# EAGLE design mahmuduino (EAGLE 9.6.1)
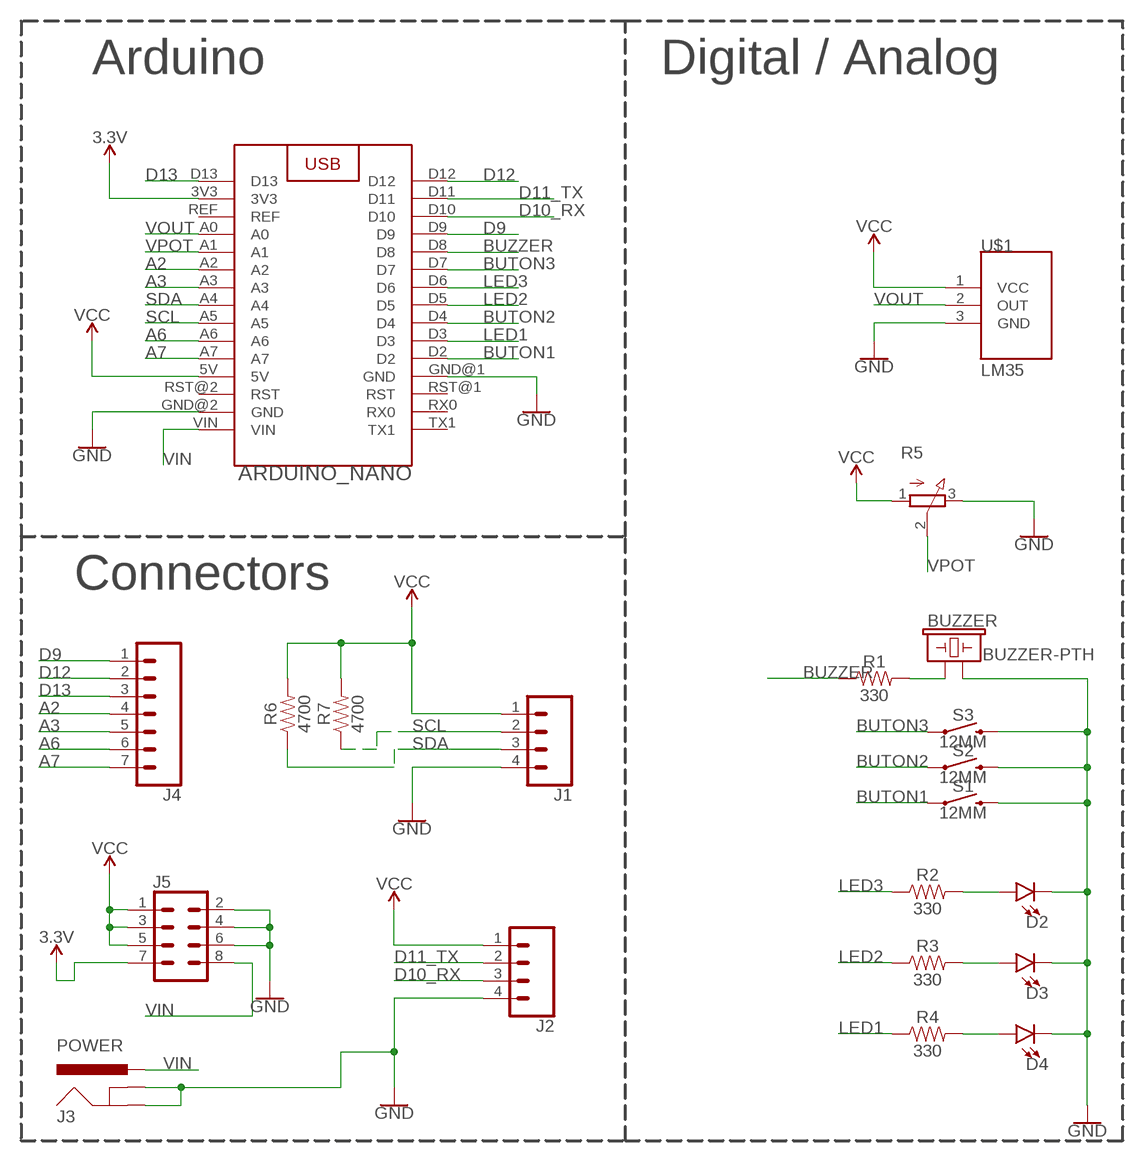
[diagram p0: schematic, sheet 1]

## Parts
ARDUINO_NANO  ARDUINO_NANO  [ARDUINO_NANO]
BUZZER  BUZZER-PTH  [BUZZER-12MM]
D2  LED-3MM-NO_SILK  [LED_3MM-NS]
D3  LED-3MM-NO_SILK  [LED_3MM-NS]
D4  LED-3MM-NO_SILK  [LED_3MM-NS]
J1  CONN_04  [1X04]
J2  CONN_04  [1X04]
J3  POWER  POWER_JACK  [POWER_JACK_PTH]
J4  CONN_07  [1X07]
J5  CONN_04X2  [2X4]
R1  330  1KOHM-HORIZ-1/4W-5%  [AXIAL-0.3]
R2  330  1KOHM-HORIZ-1/4W-5%  [AXIAL-0.3]
R3  330  1KOHM-HORIZ-1/4W-5%  [AXIAL-0.3]
R4  330  1KOHM-HORIZ-1/4W-5%  [AXIAL-0.3]
R5  3RP/1610N  [3RP/1610N]
R6  4700  1KOHM-HORIZ-1/4W-5%  [AXIAL-0.3]
R7  4700  1KOHM-HORIZ-1/4W-5%  [AXIAL-0.3]
S1  12MM  MOMENTARY-SWITCH-SPST-PTH-12MM  [TACTILE_SWITCH_PTH_12MM]
S2  12MM  MOMENTARY-SWITCH-SPST-PTH-12MM  [TACTILE_SWITCH_PTH_12MM]
S3  12MM  MOMENTARY-SWITCH-SPST-PTH-12MM  [TACTILE_SWITCH_PTH_12MM]
U$1  LM35  [TO-92]

## Nets
3.3V: ARDUINO_NANO.3V3 J5.7
A2: ARDUINO_NANO.A2 J4.4
A3: ARDUINO_NANO.A3 J4.5
A6: ARDUINO_NANO.A6 J4.6
A7: ARDUINO_NANO.A7 J4.7
BUTON1: ARDUINO_NANO.D2 S1.1
BUTON2: ARDUINO_NANO.D4 S2.1
BUTON3: ARDUINO_NANO.D7 S3.1
BUZZER: ARDUINO_NANO.D8 R1.P$1
D9: ARDUINO_NANO.D9 J4.1
D10_RX: ARDUINO_NANO.D10 J2.3
D11_TX: ARDUINO_NANO.D11 J2.2
D12: ARDUINO_NANO.D12 J4.2
D13: ARDUINO_NANO.D13 J4.3
GND: ARDUINO_NANO.GND@1(GND) ARDUINO_NANO.GND@2(GND) BUZZER.- D2.K(C) D3.K(C) D4.K(C) J1.4 J2.4 J3.GND J3.GNDBREAK J5.2 J5.4 J5.6 R5.3(E) S1.3 S2.3 S3.3 U$1.3(GND)
LED1: ARDUINO_NANO.D3 R4.P$1
LED2: ARDUINO_NANO.D5 R3.P$1
LED3: ARDUINO_NANO.D6 R2.P$1
N$2: BUZZER.+ R1.P$2
N$6: D2.A R2.P$2
N$7: D3.A R3.P$2
N$8: D4.A R4.P$2
SCL: ARDUINO_NANO.A5 J1.2 R7.P$1
SDA: ARDUINO_NANO.A4 J1.3 R6.P$1
VCC: ARDUINO_NANO.5V J1.1 J2.1 J5.1 J5.3 J5.5 R5.1(A) R6.P$2 R7.P$2 U$1.1(VCC)
VIN: ARDUINO_NANO.VIN J3.PWR J5.8
VOUT: ARDUINO_NANO.A0 U$1.2(OUT)
VPOT: ARDUINO_NANO.A1 R5.2(S)
Unconnected: ARDUINO_NANO.REF ARDUINO_NANO.RST@1(RST) ARDUINO_NANO.RST@2(RST) ARDUINO_NANO.RX0 ARDUINO_NANO.TX1

## Notes on the sheet
- Arduino | Digital / Analog
- Connectors

## Library data of the parts
ARDUINO_NANO = LezzetliRobotTarifleriLib:ARDUINO_NANO: Ardunio Nano Device
BUZZER = SparkFun-Electromechanical:BUZZER: Buzzer Small round buzzers that operate around the audible 2kHz range. You can use these as speakers to create simple music or user interfaces. Variant Overview: PTH - Mini Speaker - PC Mount 12mm 2.048kHz <https://www.sparkfun.com/products/7950> PTH_KIT - Mini Speaker - PC Mount 12mm 2.048kHz <https://www.sparkfun.com/products/7950> KIT simplifies soldering by adding stop mask to one side of the pads. PTH_NO_SILK - Mini Speaker - PC Mount 12mm 2.048kHz <https://www.sparkfun.com/products/7950> No silkscreen indicator of buzzer outline. PTH_KIT_NO_SILK - Mini Speaker - PC Mount 12mm 2.048kHz <https://www.sparkfun.com/products/7950> KIT package w/o silkscreen SMD - Buzzer Audio Magnetic (CCV-084B16) SMD buzzer used on, e.g. the LilyPad Buzzer <https://www.sparkfun.com/products/8463> and RFID USB Reader <https://www.sparkfun.com/products/9963>. SMD_KIT - Buzzer Audio Magnetic (CCV-084B16) SMD Buzzer with elongated pins to make soldering easier. Used on the SparkFun Simon Says - Surface Mount Soldering Kit <https://www.sparkfun.com/products/10935>.; PROD_ID: COMP-08253; SF_SKU: COM-07950
D2-D4 = SparkFun-LED:LED: LED (Generic) Standard schematic elements and footprints for 5mm, 3mm, 1206, and 0603 sized LEDs. Generic LEDs with no color specified.
J1 J2 = SparkFun-Connectors:CONN_04: Multi connection point. Often used as Generic Header-pin footprint for 0.1 inch spaced/style header connections On any of the 0.1 inch spaced packages, you can populate with these: Break Away Headers - Straight <https://www.sparkfun.com/products/116> (PRT-00116) Break Away Male Headers - Right Angle <https://www.sparkfun.com/products/553> (PRT-00553) Female Headers <https://www.sparkfun.com/products/115> (PRT-00115) Break Away Headers - Machine Pin <https://www.sparkfun.com/products/117> (PRT-00117) Break Away Female Headers - Swiss Machine Pin <https://www.sparkfun.com/products/743> (PRT-00743) For SCREWTERMINALS and SPRING TERMINALS visit here: Screw Terimnals on SparkFun.com <https://www.sparkfun.com/search/results?term=Screw+Terminals> (5mm/3.5mm/2.54mm spacing) This device is also useful as a general connection point to wire up your design to another part of your project. Our various solder wires solder well into these plated through hole pads. Hook-Up Wire - Assortment (Stranded, 22 AWG) <https://www.sparkfun.com/products/11375> (PRT-11375) Hook-Up Wire - Assortment (Solid Core, 22 AWG) <https://www.sparkfun.com/products/11367> (PRT-11367) View the entire wire category on our website here <https://www.sparkfun.com/categories/141> Special notes: Molex polarized connector foot print use with SKU : PRT-08231 with associated crimp pins and housings. 1MM SMD Version SKU: PRT-10208; PROD_ID: CONN-09696
J3 = SparkFun-Connectors:POWER_JACK: Power Jack Connector This is the standard 5.5mm barrel jack for power. The PTH is the most common, proven, reliable, footprint. The Slot footprint only works if the mill layer is transmitted to the PCB fab house so be warned. Here are the connectors we sell at SparkFun: DC Barrel Power Jack/Connector <https://www.sparkfun.com/products/119> (PRT-00119) DC Barrel Power Jack/Connector (SMD) <https://www.sparkfun.com/products/12748> (PRT-12748) DC Barrel Jack Adapter - Breadboard Compatible <https://www.sparkfun.com/products/10811> (PRT-10811) It is used on this SparkFun product (and many, many others): SparkFun RedBoard - Programmed with Arduino <https://www.sparkfun.com/products/12757> (DEV-12757) Also, if you need a mating power supply or connector, please check these out: Wall Adapter Power Supply - 9VDC 650mA <https://www.sparkfun.com/products/298> (TOL-00298) DC Barrel Jack Adapter - Male <https://www.sparkfun.com/products/10287> (PRT-10287); PROD_ID: CONN-08197
J4 = SparkFun-Connectors:CONN_07: Multi connection point. Often used as Generic Header-pin footprint for 0.1 inch spaced/style header connections On any of the 0.1 inch spaced packages, you can populate with these: Break Away Headers - Straight <https://www.sparkfun.com/products/116> (PRT-00116) Break Away Male Headers - Right Angle <https://www.sparkfun.com/products/553> (PRT-00553) Female Headers <https://www.sparkfun.com/products/115> (PRT-00115) Break Away Headers - Machine Pin <https://www.sparkfun.com/products/117> (PRT-00117) Break Away Female Headers - Swiss Machine Pin <https://www.sparkfun.com/products/743> (PRT-00743) For SCREWTERMINALS and SPRING TERMINALS visit here: Screw Terimnals on SparkFun.com <https://www.sparkfun.com/search/results?term=Screw+Terminals> (5mm/3.5mm/2.54mm spacing) This device is also useful as a general connection point to wire up your design to another part of your project. Our various solder wires solder well into these plated through hole pads. Hook-Up Wire - Assortment (Stranded, 22 AWG) <https://www.sparkfun.com/products/11375> (PRT-11375) Hook-Up Wire - Assortment (Solid Core, 22 AWG) <https://www.sparkfun.com/products/11367> (PRT-11367) View the entire wire category on our website here <https://www.sparkfun.com/categories/141> Special notes: Molex polarized connector foot print use with SKU : PRT-08231 with associated crimp pins and housings. 1MM SMD Version SKU: PRT-10208 NOTES ON THE VARIANTS LOCK and LOCK_LONGPADS... This footprint was designed to help hold the alignment of a through-hole component (i.e. 6-pin header) while soldering it into place. You may notice that each hole has been shifted either up or down by 0.005 of an inch from it's more standard position (which is a perfectly straight line). This slight alteration caused the pins (the squares in the middle) to touch the edges of the holes. Because they are alternating, it causes a "brace" to hold the component in place. 0.005 has proven to be the perfect amount of "off-center" position when using our standard breakaway headers. Although looks a little odd when you look at the bare footprint, once you have a header in there, the alteration is very hard to notice. Also,if you push a header all the way into place, it is covered up entirely on the bottom side.
J5 = SparkFun-Connectors:CONN_04X2: Multi connection point. Often used as Generic Header-pin footprint for 0.1 inch spaced/style header connections On any of the 0.1 inch spaced packages, you can populate with these: Break Away Headers - Straight <https://www.sparkfun.com/products/116> (PRT-00116) Break Away Male Headers - Right Angle <https://www.sparkfun.com/products/553> (PRT-00553) Female Headers <https://www.sparkfun.com/products/115> (PRT-00115) Break Away Headers - Machine Pin <https://www.sparkfun.com/products/117> (PRT-00117) Break Away Female Headers - Swiss Machine Pin <https://www.sparkfun.com/products/743> (PRT-00743)
R1-R4 R6 R7 = SparkFun-Resistors:1KOHM: 1kΩ resistor A resistor is a passive two-terminal electrical component that implements electrical resistance as a circuit element. Resistors act to reduce current flow, and, at the same time, act to lower voltage levels within circuits. - Wikipedia; PROD_ID: RES-08380; VALUE: 1k
R5 = pot:3RP/1610N: 16mm Potentiometer one level Source: http://www.alphapotentiometers.net/html/16mm_pot_2.html
S1-S3 = SparkFun-Switches:MOMENTARY-SWITCH-SPST: Momentary Switch (Pushbutton) - SPST Normally-open (NO) SPST momentary switches (buttons, pushbuttons). Variants PTH-12MM - 12mm square, through-hole Momentary Pushbutton Switch - 12mm Square <https://www.sparkfun.com/products/9190> (COM-09190) PTH-6.0MM, PTH-6.0MM-KIT - 6.0mm square, through-hole Mini Pushbutton Switch <https://www.sparkfun.com/products/97> (COM-00097) KIT package intended for soldering kit's - only one side of pads' copper is exposed. PTH-RIGHT-ANGLE-KIT - Right-angle, through-hole Right Angle Tactile Button <https://www.sparkfun.com/products/10791> - Used on SparkFun BigTime Watch Kit <https://www.sparkfun.com/products/11734> SMD-12MM - 12mm square, surface-mount Tactile Button - SMD (12mm) <https://www.sparkfun.com/products/12993> (COM-12993) Used on SparkFun PicoBoard <https://www.sparkfun.com/products/11888> SMD-4.5MM - 4.5mm Square Trackball Switch Used on SparkFun Blackberry Trackballer Breakout <https://www.sparkfun.com/products/13169> SMD-4.6MMX2.8MM - 4.60mm x 2.80mm, surface mount Used on SparkFun SAMD21 Mini Breakout <https://www.sparkfun.com/products/13664> SMD-5.2MM, SMD-5.2-REDUNDANT - 5.2mm square, surface-mount Mini Pushbutton Switch - SMD <https://www.sparkfun.com/products/8720> (COM-08720) Used on Arduino Pro Mini <https://www.sparkfun.com/products/11114> REDUNDANT package connects both switch circuits together SMD-6.0X3.5MM - 6.0 x 3.5mm, surface mount Momentary Reset Switch SMD <https://www.sparkfun.com/products/8229> (COM-08229) SMD-6.2MM-TALL - 6.2mm square, surface mount Tactile Button - SMD (6mm) <https://www.sparkfun.com/products/12992> Used on SparkFun Digital Sandbox <https://www.sparkfun.com/products/12651> SMD-RIGHT-ANGLE - Right-angle, surface mount Used on SparkFun Block for Intel® Edison - Arduino <https://www.sparkfun.com/products/13036>; PROD_ID: SWCH-09185; SF_SKU: COM-09190
U$1 = LezzetliRobotTarifleriLib:LM35

## Board
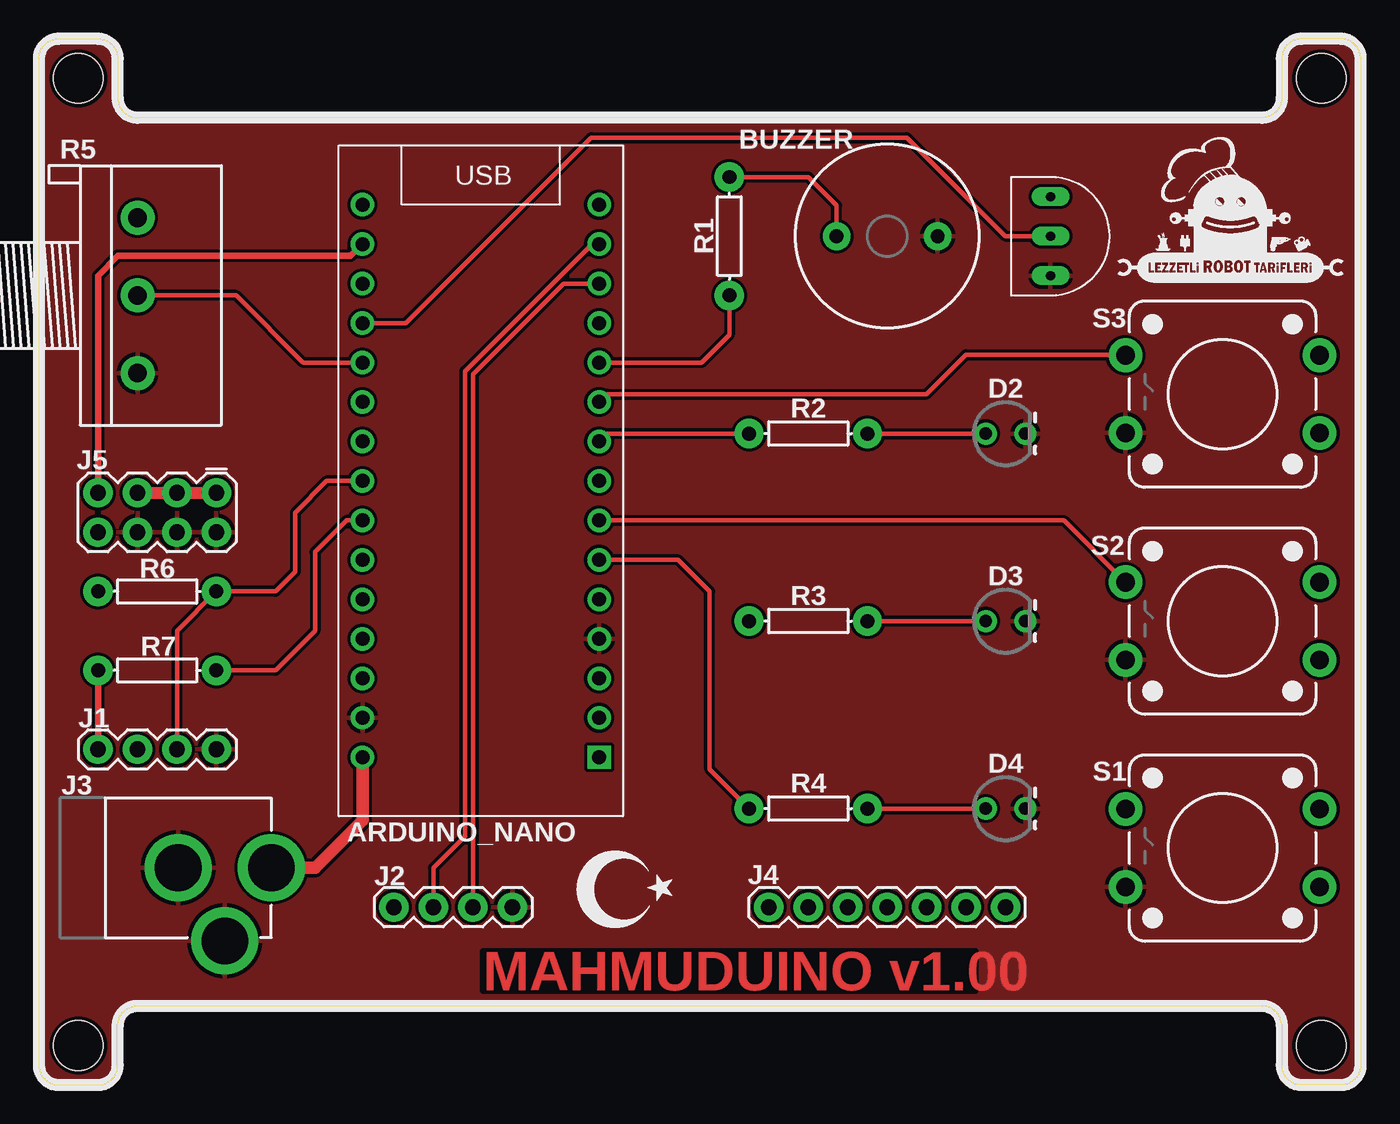
[diagram p1: board, top side]
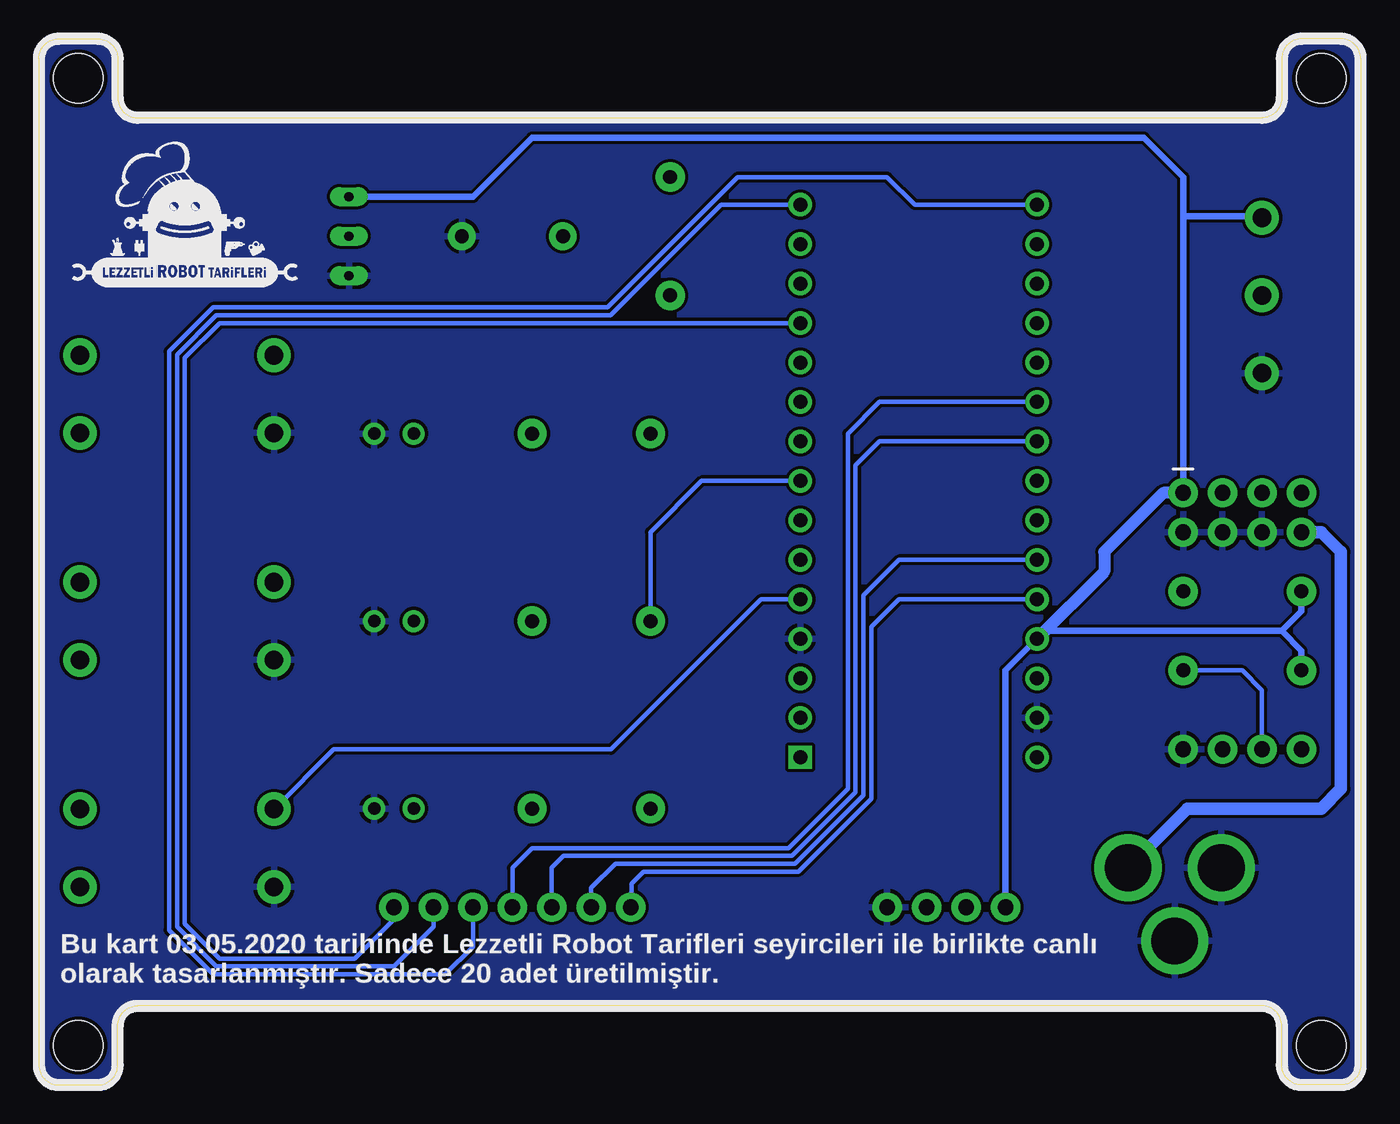
[diagram p2: board, bottom side, seen from below]

Size 85.09 x 67.31 mm. Coordinates in mm from the lower left corner, seen from the top.
Outline: 80.01,1.27 80.01,3.81 arc90 78.74,5.08 6.35,5.08 arc90 5.08,3.81 5.08,1.27 arc-90 3.81,0 1.27,0 arc-90 0,1.27 0,66.04 arc-90 1.27,67.31 3.81,67.31 arc-90 5.08,66.04 5.08,63.5 arc90 6.35,62.23 78.74,62.23 arc90 80.01,63.5 80.01,66.04 arc-90 81.28,67.31 83.82,67.31 arc-90 85.09,66.04 85.09,1.27 arc-90 83.82,0 81.28,0 arc-90 80.01,1.27
Copper layers (1*16): Top 0.035mm / dielectric 1.5mm / Bottom 0.035mm
Design rules "SparkFun": minimum track width 8mil, minimum drill 20mil, track to track 8mil, track to pad 8mil, pad to pad 8mil, via to via 8mil, smd to smd 8mil, copper to edge 10mil, drill to drill 8mil, minimum pad ring 12mil, minimum via ring 10mil, stop-mask expansion 4mil, vias tented up to drill 25mil, thermal gap 10mil
Holes 3.2 mm at 2.54,64.77 82.55,64.77 82.55,2.54 2.54,2.54

### Footprints (pad centres in the part's own frame; a part is rotated, then mirrored left to right if it is on the bottom)
ARDUINO_NANO = drill 0.9: 3V3 7.112,-14.732; 5V 7.112,10.668; A0 7.112,-9.652; A1 7.112,-7.112; A2 7.112,-4.572; A3 7.112,-2.032; A4 7.112,0.508; A5 7.112,3.048; A6 7.112,5.588; A7 7.112,8.128; D2 -8.128,8.128; D3 -8.128,5.588; D4 -8.128,3.048; D5 -8.128,0.508; D6 -8.128,-2.032; D7 -8.128,-4.572; D8 -8.128,-7.112; D9 -8.128,-9.652; D10 -8.128,-12.192; D11 -8.128,-14.732; D12 -8.128,-17.272; D13 7.112,-17.272; GND@1 -8.128,10.668; GND@2 7.112,15.748; REF 7.112,-12.192; RST@1 -8.128,13.208; RST@2 7.112,13.208; RX0 -8.128,15.748; VIN 7.112,18.288 | drill 0.9 square: TX1 -8.128,18.288
BUZZER-12MM = drill 0.9 pad 1.778: + 3.25,0; - -3.25,0
LED_3MM-NS = drill 0.813: A -1.27,0; K 1.27,0
1X04 = drill 1.016 pad 1.88: 1 0,0; 2 2.54,0; 3 5.08,0; 4 7.62,0
POWER_JACK_PTH = drill 2.997 pad 4.318: GND 0,7.7; GNDBREAK 4.7,10.7; PWR 0,13.7
1X07 = drill 1.016 pad 1.88: 1 0,0; 2 2.54,0; 3 5.08,0; 4 7.62,0; 5 10.16,0; 6 12.7,0; 7 15.24,0
2X4 = drill 1.016 pad 1.88: 1 -3.81,-1.27; 2 -3.81,1.27; 3 -1.27,-1.27; 4 -1.27,1.27; 5 1.27,-1.27; 6 1.27,1.27; 7 3.81,-1.27; 8 3.81,1.27
AXIAL-0.3 = drill 0.9 pad 1.88: P$1 -3.81,0; P$2 3.81,0
3RP/1610N = drill 1.2 pad 2.184: 1 -5,0; 2 0,0; 3 5,0
TACTILE_SWITCH_PTH_12MM = drill 1.2 pad 2.159: 1 6.25,-2.5; 2 -6.25,-2.5; 3 6.25,2.5; 4 -6.25,2.5
TO-92 = drill 0.6 long: 1 -1.27,0; 2 1.27,0; 3 3.81,0

### Placement (x,y rotation side)
ARDUINO_NANO  27.94,39.37 180 top
BUZZER  54.61,54.61 180 top
D2  62.23,41.91 0 top
D3  62.23,29.84 0 top
D4  62.23,17.78 0 top
J1  3.81,21.59 0 top
J2  22.86,11.43 0 top
J3  1.27,13.97 270 top
J4  62.23,11.43 180 top
J5  7.62,36.83 180 top
R1  44.45,54.61 90 top
R2  49.53,41.91 0 top
R3  49.53,29.84 0 top
R4  49.53,17.78 0 top
R5  6.35,50.8 270 top
R6  7.62,31.75 180 top
R7  7.62,26.67 180 top
S1  76.2,15.24 180 top
S2  76.2,29.84 180 top
S3  76.2,44.45 180 top
U$1  65.13,55.88 270 top
U$2  [LRT-LOGO-0,0125-B]  76.58,51.1 0 top
U$3  [LRT-LOGO-0,0125-B]  75.82,50.8 0 bottom
U$9  [TR_MINI]  33.44,9.54 0 top

### Tracks (layer width: path | path; a pad name or v marks a point on that pad's centre or on a via)
3.3V
  Top 0.406: ARDUINO_NANO.3V3 20.07,53.34 5.08,53.34 3.81,52.07 J5.7
A2
  Bottom 0.305: ARDUINO_NANO.A2 30.99,43.94 33.02,41.91 33.02,19.05 36.83,15.24 53.34,15.24 54.61,13.97 J4.4
A3
  Bottom 0.305: ARDUINO_NANO.A3 30.99,41.4 32.51,39.88 32.51,18.84 36.62,14.73 51.31,14.73 52.07,13.97 J4.5
A6
  Bottom 0.305: ARDUINO_NANO.A6 29.72,33.78 32,31.5 32,18.63 36.41,14.22 47.98,14.22 49.53,12.68 J4.6
A7
  Bottom 0.305: ARDUINO_NANO.A7 29.72,31.24 31.5,29.46 31.5,18.42 36.2,13.72 46.18,13.72 46.94,12.95 46.94,11.43 J4.7
BUTON1
  Bottom 0.305: ARDUINO_NANO.D2 38.61,31.24 48.26,21.59 66.1,21.59 S1.1
BUTON2
  Top 0.305: ARDUINO_NANO.D4 65.97,36.32 S2.1
BUTON3
  Top 0.305: ARDUINO_NANO.D7 36.58,44.45 57.15,44.45 59.69,46.99 69.91,46.99 S3.1
BUZZER
  Top 0.305: R1.P$1 44.45,48.26 42.67,46.48 ARDUINO_NANO.D8
D9
  Bottom 0.305: ARDUINO_NANO.D9 73.45,49.02 75.69,46.78 75.69,10.37 73.45,8.13 64.77,8.13 62.23,10.67 J4.1
D10_RX
  Top 0.305: ARDUINO_NANO.D10 33.78,51.56 27.94,45.72 J2.3
D11_TX
  Top 0.305: J2.2 25.4,13.97 27.43,16 27.43,45.93 35.6,54.1 ARDUINO_NANO.D11
D12
  Bottom 0.305: ARDUINO_NANO.D12 41.17,56.64 48.29,49.53 73.66,49.53 76.2,46.99 76.2,10.16 73.66,7.62 62.23,7.62 59.69,10.16 J4.2
D13
  Bottom 0.305: ARDUINO_NANO.D13 28.7,56.64 30.48,58.42 40.11,58.42 48.5,50.04 73.87,50.04 76.71,47.2 76.71,9.95 73.87,7.11 58.93,7.11 57.15,8.89 J4.3
GND
  pour Top: 87.63,69.85 -2.54,69.85 -2.54,-2.54 3.81,-2.54 87.63,-2.54
  pour Bottom: -5.08,62.23 -5.08,-5.08 45.72,-5.08 90.17,-5.08 90.17,-1.27 90.17,71.12 90.17,72.39 -5.08,72.39
LED1
  Top 0.305: R4.P$1 43.18,20.32 43.18,31.75 41.15,33.78 ARDUINO_NANO.D3
LED2
  Bottom 0.305: ARDUINO_NANO.D5 42.42,38.86 45.72,35.56 R3.P$1
LED3
  Top 0.305: ARDUINO_NANO.D6 36.58,41.91 R2.P$1
N$2
  Top 0.305: BUZZER.+ 51.36,56.59 49.53,58.42 R1.P$2
N$6
  Top 0.305: R2.P$2 D2.A
N$7
  Top 0.305: D3.A R3.P$2
N$8
  Top 0.305: R4.P$2 D4.A
SCL
  Top 0.305: ARDUINO_NANO.A5 19.81,36.32 17.78,34.29 17.78,29.21 15.24,26.67 R7.P$1
  Bottom 0.305: J1.2 6.35,25.4 7.62,26.67 R7.P$1
SDA
  Top 0.305: ARDUINO_NANO.A4 18.54,38.86 16.51,36.83 16.51,33.02 15.24,31.75 R6.P$1 8.89,29.21 J1.3
VCC
  Top 0.406: J1.1 R7.P$2
  Top 0.762: J5.5 J5.3 J5.1
  Bottom 0.406: R6.P$2 3.81,30.48 5.08,29.21 | R7.P$2 3.81,27.94 5.08,29.21 | 5.08,29.21 20.32,29.21 ARDUINO_NANO.5V 22.86,26.67 J2.1 | U$1.1 57.15,57.15 53.34,60.96 13.97,60.96 11.43,58.42 11.43,55.88 | J5.1 11.43,55.88 | R5.1 6.43,55.88 11.43,55.88
  Bottom 0.762: ARDUINO_NANO.5V 16.51,33.02 16.51,34.29 12.7,38.1 J5.1
VIN
  Top 0.813: J3.PWR 17.78,13.97 20.83,17.02 ARDUINO_NANO.VIN
  Bottom 0.813: J5.8 2.54,35.56 1.27,34.29 1.27,19.05 2.54,17.78 11.16,17.78 J3.PWR
VOUT
  Top 0.305: ARDUINO_NANO.A0 23.62,49.02 35.56,60.96 55.88,60.96 62.23,54.61 U$1.2
VPOT
  Top 0.305: ARDUINO_NANO.A1 17.02,46.48 12.7,50.8 R5.2

### Text on the board
Top: MAHMUDUINO v1.00
bPlace: Bu kart 03.05.2020 tarihinde Lezzetli Robot Tarifleri seyircileri ile birlikte canlı / olarak tasarlanmıştır. Sadece 20 adet üretilmiştir.
tStop: MAHMUDUINO v1.00